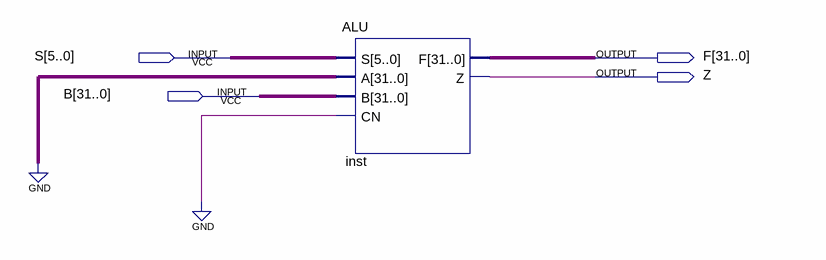
[diagram p0: schematic sheet]
// Quartus schematic ALUTest.bdf as structural Verilog: 1 symbols, 4 pins
module ALUTest (
  input  [5:0] S,
  input  [31:0] B,
  output [31:0] F,
  output Z
);

  ALU inst (.S(S), .A({32{1'b0}}), .B(B), .CN(1'b0), .F(F), .Z(Z));
endmodule
